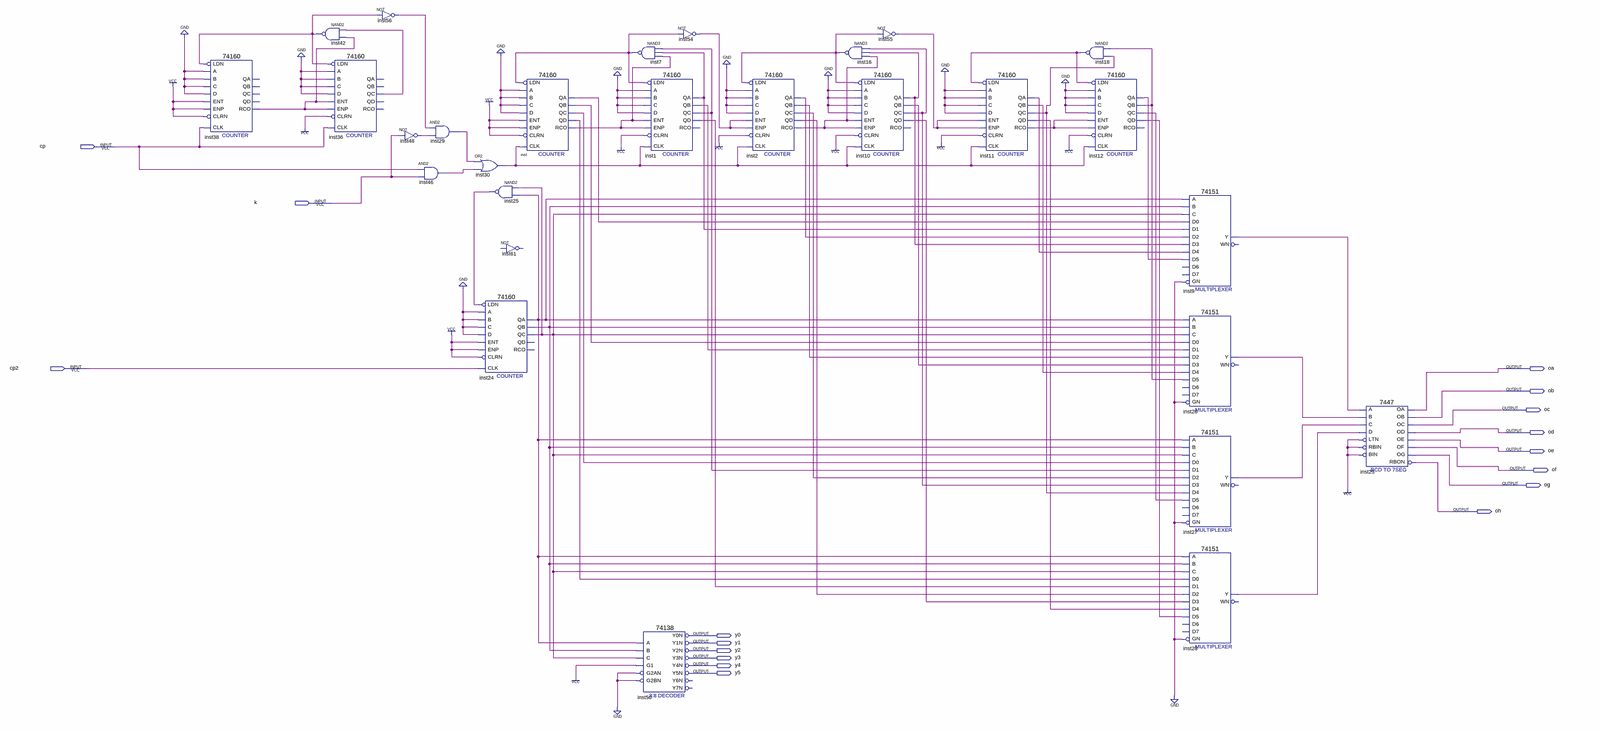
[diagram p0: schematic sheet, whole]
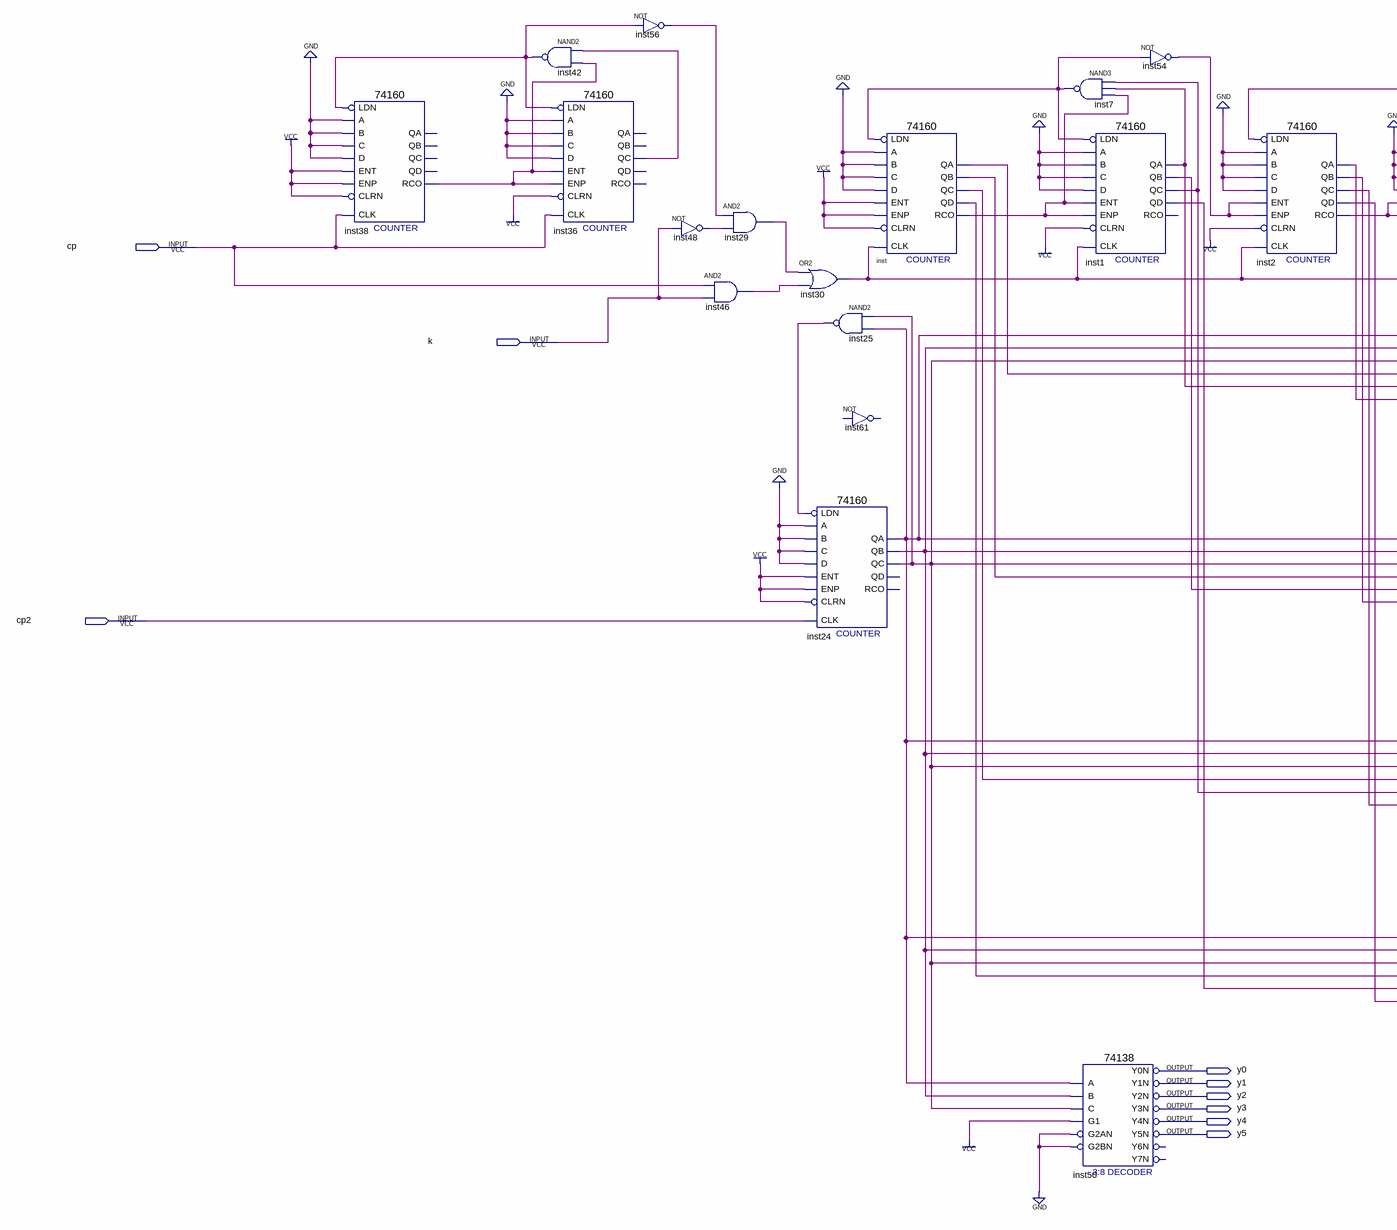
[diagram p1: schematic sheet, left part]
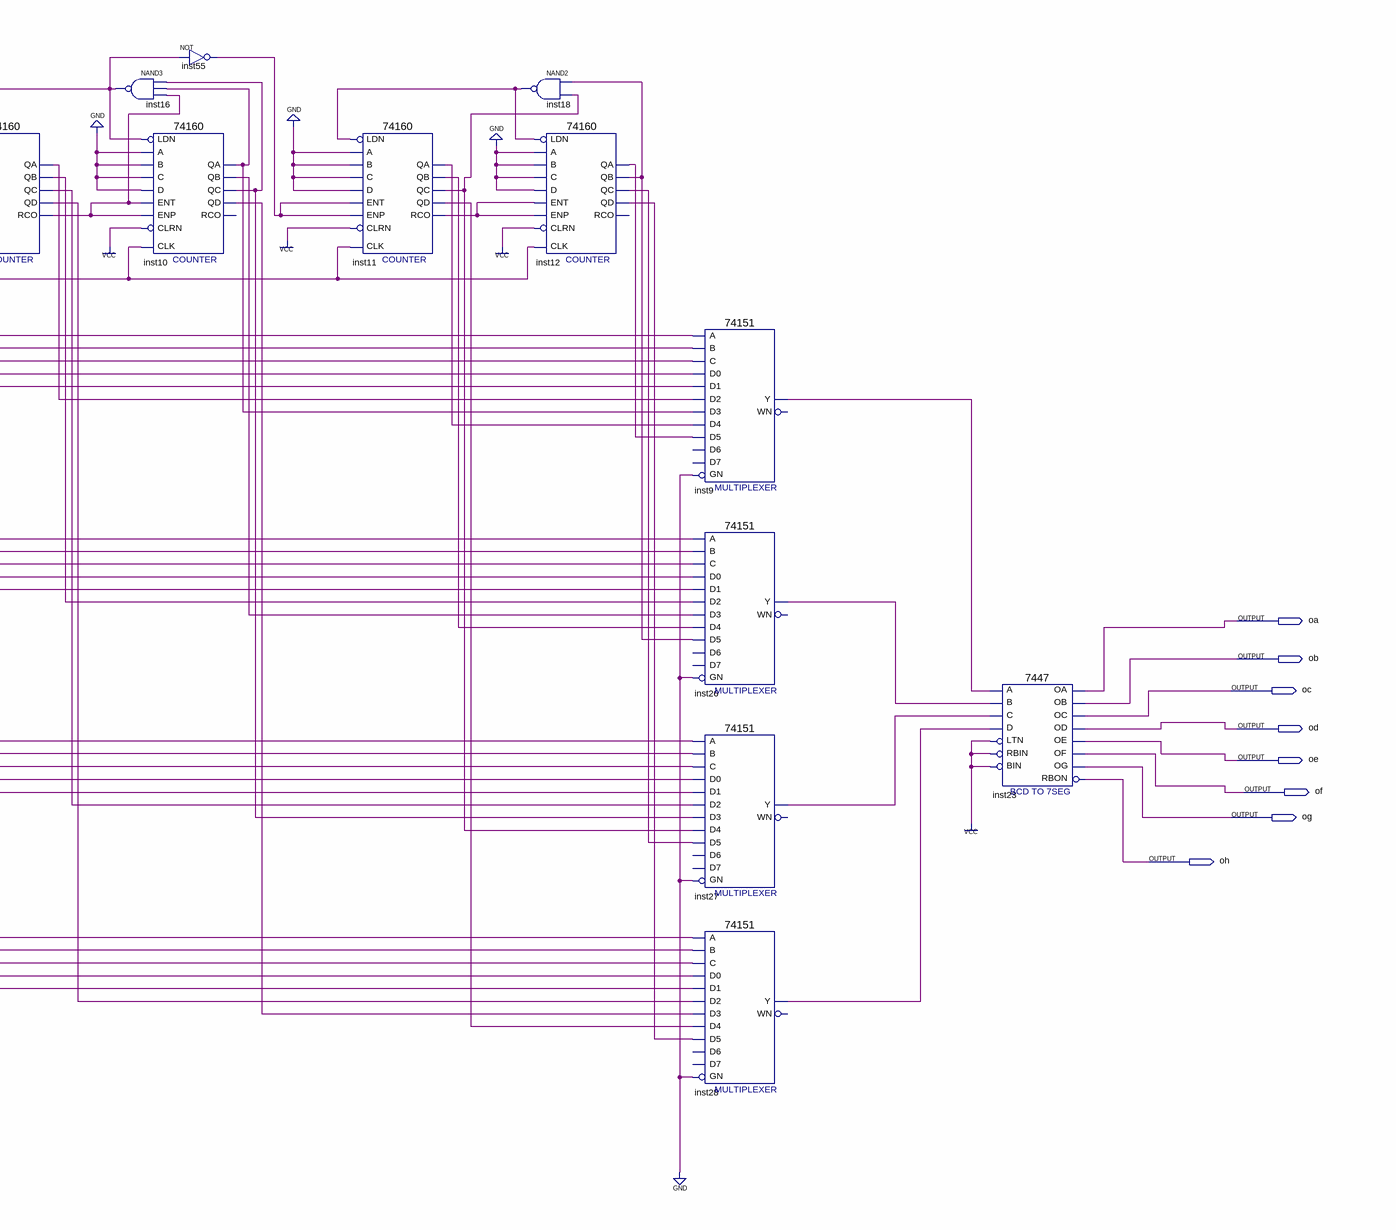
[diagram p2: schematic sheet, right part]
// Quartus schematic 24.bdf as structural Verilog: 28 symbols, 17 pins
module \24  (
  input  cp,
  input  k,
  input  cp2,
  output oa,
  output ob,
  output oc,
  output od,
  output oe,
  output of,
  output og,
  output oh,
  output y0,
  output y1,
  output y2,
  output y3,
  output y4,
  output y5
);

  wire inst1_qa, inst1_qb, inst1_qc, inst1_qd, inst2_qa, inst2_qb, inst2_qc, inst2_qd, inst2_rco, inst7_out,
       inst9_y, inst10_qa, inst10_qb, inst10_qc, inst10_qd, inst11_qa, inst11_qb, inst11_qc, inst11_qd,
       inst11_rco, inst12_qa, inst12_qb, inst12_qc, inst12_qd, inst16_out, inst18_out, inst24_qa, inst24_qb,
       inst24_qc, inst25_out, inst26_y, inst27_y, inst28_y, inst29_out, inst30_out, inst36_qc, inst38_rco,
       inst42_out, inst46_out, inst48_out, inst54_out, inst55_out, inst56_out, inst_qa, inst_qb, inst_qc,
       inst_qd, inst_rco;

  \74160  inst38 (
    .CLK(cp), .ENT(1'b1), .A(1'b0), .B(1'b0), .C(1'b0), .D(1'b0), .LDN(inst42_out), .ENP(1'b1), .CLRN(1'b1),
    .RCO(inst38_rco));  // open: QD, QA, QB, QC
  nand inst42 (inst42_out, inst36_qc, inst38_rco);
  \74160  inst36 (
    .CLK(cp), .ENT(inst38_rco), .A(1'b0), .B(1'b0), .C(1'b0), .D(1'b0), .LDN(inst42_out), .ENP(inst38_rco),
    .CLRN(1'b1), .QC(inst36_qc));  // open: QD, QA, QB, RCO
  not inst56 (inst56_out, inst42_out);
  not inst48 (inst48_out, k);
  and inst46 (inst46_out, cp, k);
  and inst29 (inst29_out, inst56_out, inst48_out);
  or inst30 (inst30_out, inst29_out, inst46_out);
  \74160  inst24 (
    .CLK(cp2), .ENT(1'b1), .A(1'b0), .B(1'b0), .C(1'b0), .D(1'b0), .LDN(inst25_out), .ENP(1'b1), .CLRN(1'b1),
    .QA(inst24_qa), .QB(inst24_qb), .QC(inst24_qc));  // open: QD, RCO
  nand inst25 (inst25_out, inst24_qc, inst24_qa);
  // NOT inst61 is placed but not wired
  \74160  inst (
    .CLK(inst30_out), .ENT(1'b1), .A(1'b0), .B(1'b0), .C(1'b0), .D(1'b0), .LDN(inst7_out), .ENP(1'b1),
    .CLRN(1'b1), .QD(inst_qd), .QA(inst_qa), .QB(inst_qb), .QC(inst_qc), .RCO(inst_rco));
  nand inst7 (inst7_out, inst1_qc, inst1_qa, inst_rco);
  \74160  inst1 (
    .CLK(inst30_out), .ENT(inst_rco), .A(1'b0), .B(1'b0), .C(1'b0), .D(1'b0), .LDN(inst7_out),
    .ENP(inst_rco), .CLRN(1'b1), .QD(inst1_qd), .QA(inst1_qa), .QB(inst1_qb), .QC(inst1_qc));  // open: RCO
  \74138  inst50 (
    .A(inst24_qa), .B(inst24_qb), .G1(1'b1), .C(inst24_qc), .G2AN(1'b0), .G2BN(1'b0), .Y0N(y0), .Y1N(y1),
    .Y2N(y2), .Y3N(y3), .Y4N(y4), .Y5N(y5));  // open: Y6N, Y7N
  not inst54 (inst54_out, inst7_out);
  \74160  inst2 (
    .CLK(inst30_out), .ENT(inst54_out), .A(1'b0), .B(1'b0), .C(1'b0), .D(1'b0), .LDN(inst16_out),
    .ENP(inst54_out), .CLRN(1'b1), .QD(inst2_qd), .QA(inst2_qa), .QB(inst2_qb), .QC(inst2_qc), .RCO(inst2_rco));
  nand inst16 (inst16_out, inst10_qc, inst10_qa, inst2_rco);
  \74160  inst10 (
    .CLK(inst30_out), .ENT(inst2_rco), .A(1'b0), .B(1'b0), .C(1'b0), .D(1'b0), .LDN(inst16_out),
    .ENP(inst2_rco), .CLRN(1'b1), .QD(inst10_qd), .QA(inst10_qa), .QB(inst10_qb), .QC(inst10_qc));  // open: RCO
  not inst55 (inst55_out, inst16_out);
  \74160  inst11 (
    .CLK(inst30_out), .ENT(inst55_out), .A(1'b0), .B(1'b0), .C(1'b0), .D(1'b0), .LDN(inst18_out),
    .ENP(inst55_out), .CLRN(1'b1), .QD(inst11_qd), .QA(inst11_qa), .QB(inst11_qb), .QC(inst11_qc),
    .RCO(inst11_rco));
  nand inst18 (inst18_out, inst12_qb, inst11_qc);
  \74160  inst12 (
    .CLK(inst30_out), .ENT(inst11_rco), .A(1'b0), .B(1'b0), .C(1'b0), .D(1'b0), .LDN(inst18_out),
    .ENP(inst11_rco), .CLRN(1'b1), .QD(inst12_qd), .QA(inst12_qa), .QB(inst12_qb), .QC(inst12_qc));  // open: RCO
  \74151  inst9 (
    .GN(1'b0), .C(inst24_qc), .B(inst24_qb), .A(inst24_qa), .D5(inst12_qa), .D0(inst_qa), .D1(inst1_qa),
    .D4(inst11_qa), .D3(inst10_qa), .D2(inst2_qa), .Y(inst9_y));  // open: D6, D7, WN
  \74151  inst26 (
    .GN(1'b0), .C(inst24_qc), .B(inst24_qb), .A(inst24_qa), .D5(inst12_qb), .D0(inst_qb), .D1(inst1_qb),
    .D4(inst11_qb), .D3(inst10_qb), .D2(inst2_qb), .Y(inst26_y));  // open: D6, D7, WN
  \74151  inst27 (
    .GN(1'b0), .C(inst24_qc), .B(inst24_qb), .A(inst24_qa), .D5(inst12_qc), .D0(inst_qc), .D1(inst1_qc),
    .D4(inst11_qc), .D3(inst10_qc), .D2(inst2_qc), .Y(inst27_y));  // open: D6, D7, WN
  \74151  inst28 (
    .GN(1'b0), .C(inst24_qc), .B(inst24_qb), .A(inst24_qa), .D5(inst12_qd), .D0(inst_qd), .D1(inst1_qd),
    .D4(inst11_qd), .D3(inst10_qd), .D2(inst2_qd), .Y(inst28_y));  // open: D6, D7, WN
  \7447  inst23 (
    .LTN(1'b1), .B(inst26_y), .C(inst27_y), .D(inst28_y), .RBIN(1'b1), .BIN(1'b1), .A(inst9_y), .OB(ob),
    .OC(oc), .OE(oe), .OD(od), .OF(of), .OG(og), .OA(oa), .RBON(oh));
endmodule
